# EAGLE schematic outer-connector (EAGLE 7.2.0)
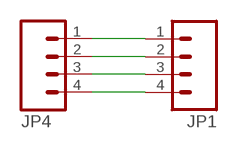
[diagram p0: schematic, sheet 1]

## Parts
JP1  M04NO_SILK_ALL_ROUND  [1X04_NO_SILK_ALL_ROUND]
JP4  M04NO_SILK_ALL_ROUND  [1X04_NO_SILK_ALL_ROUND]

## Nets
N$1: JP1.1 JP4.1
N$2: JP1.2 JP4.2
N$3: JP1.3 JP4.3
N$4: JP1.4 JP4.4

## Library data of the parts
JP1 JP4 = SparkFun-Connectors:M04: Header 4 Standard 4-pin 0.1" header. Use with straight break away headers (SKU : PRT-00116), right angle break away headers (PRT-00553), swiss pins (PRT-00743), machine pins (PRT-00117), and female headers (PRT-00115). Molex polarized connector foot print use with SKU : PRT-08231 with associated crimp pins and housings. 1MM SMD Version SKU: PRT-10208